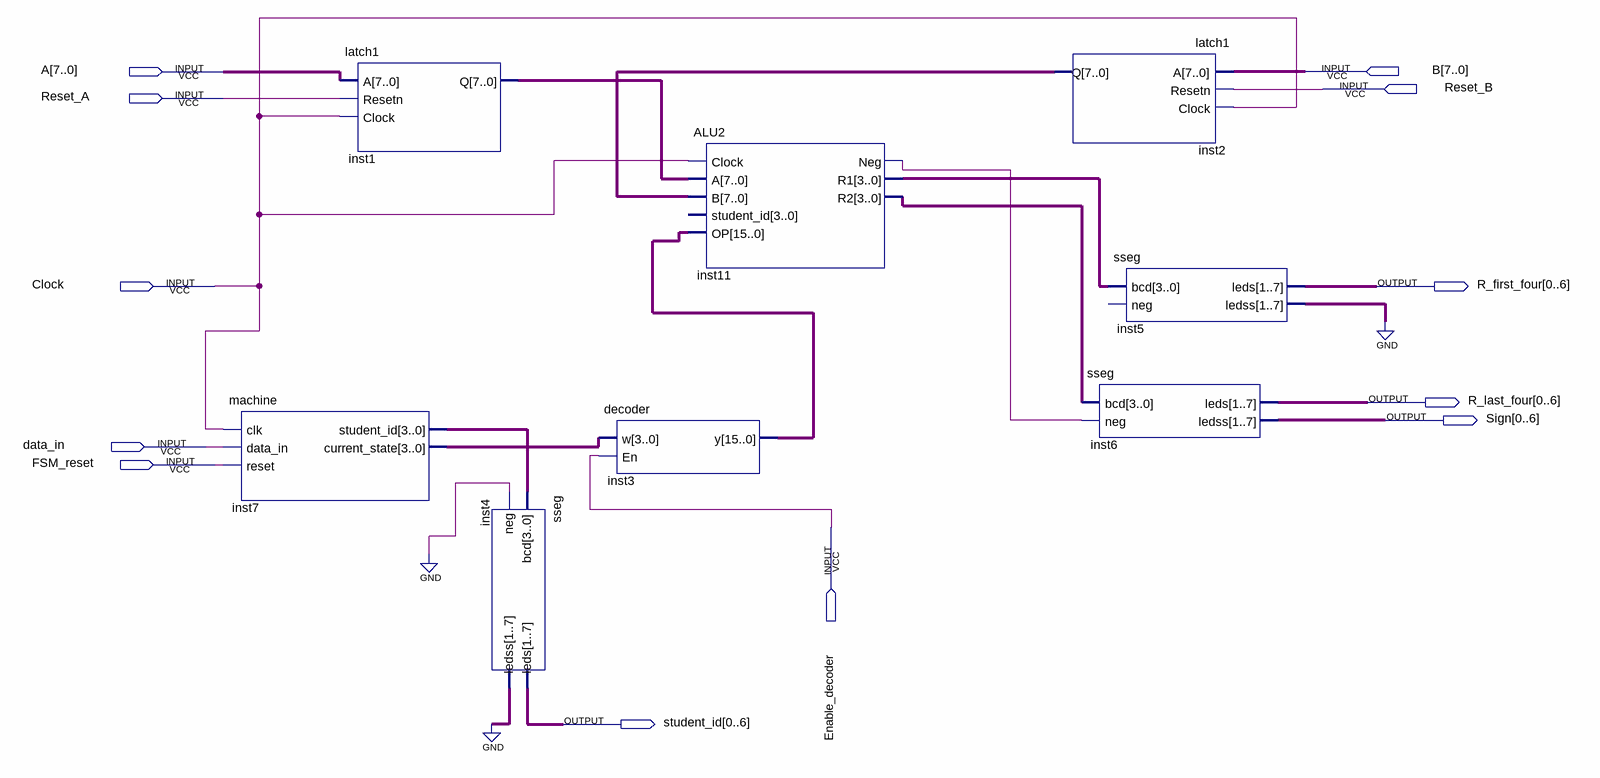
[diagram p0: schematic sheet]
// Quartus schematic lab6problem2.bdf as structural Verilog: 8 symbols, 12 pins
module lab6problem2 (
  input  [7:0] A,
  input  [7:0] B,
  input  Reset_B,
  input  Reset_A,
  input  Clock,
  input  data_in,
  input  FSM_reset,
  input  Enable_decoder,
  output [0:6] R_first_four,
  output [0:6] R_last_four,
  output [0:6] Sign,
  output [0:6] student_id
);

  wire inst11_neg;
  wire [3:0] inst7_current_state, inst7_student_id, inst11_r1, inst11_r2;
  wire [6:0] inst4_ledss, inst5_ledss;
  wire [7:0] inst1_q, inst2_q;
  wire [15:0] inst3_y;

  machine inst7 (
    .clk(Clock), .data_in(data_in), .reset(FSM_reset), .student_id(inst7_student_id),
    .current_state(inst7_current_state));
  latch1 inst1 (.A(A), .Resetn(Reset_A), .Clock(Clock), .Q(inst1_q));
  sseg inst4 (.bcd(inst7_student_id), .neg(1'b0), .leds(student_id), .ledss(inst4_ledss));
  decoder inst3 (.w(inst7_current_state), .En(Enable_decoder), .y(inst3_y));
  ALU2 inst11 (
    .Clock(Clock), .A(inst1_q), .B(inst2_q), .OP(inst3_y), .Neg(inst11_neg), .R1(inst11_r1), .R2(inst11_r2));  // open: student_id
  latch1 inst2 (.A(B), .Resetn(Reset_B), .Clock(Clock), .Q(inst2_q));
  sseg inst5 (.bcd(inst11_r1), .leds(R_first_four), .ledss(inst5_ledss));  // open: neg
  sseg inst6 (.bcd(inst11_r2), .neg(inst11_neg), .leds(R_last_four), .ledss(Sign));
  // also tied to GND on the sheet: {inst4_ledss[0], inst4_ledss[1], inst4_ledss[2], inst4_ledss[3], inst4_ledss[4], inst4_ledss[5], inst4_ledss[6], inst5_ledss[0], inst5_ledss[1], inst5_ledss[2], inst5_ledss[3], inst5_ledss[4], inst5_ledss[5], inst5_ledss[6]}
endmodule
